# Altium schematic sheet AMDC.SchDoc: Advanced Motor Drive Controller
size Letter; Engineer: Nathan Petersen; DocumentNumber: 1; Revision: v1.2; SheetNumber: 1; SheetTotal: 23
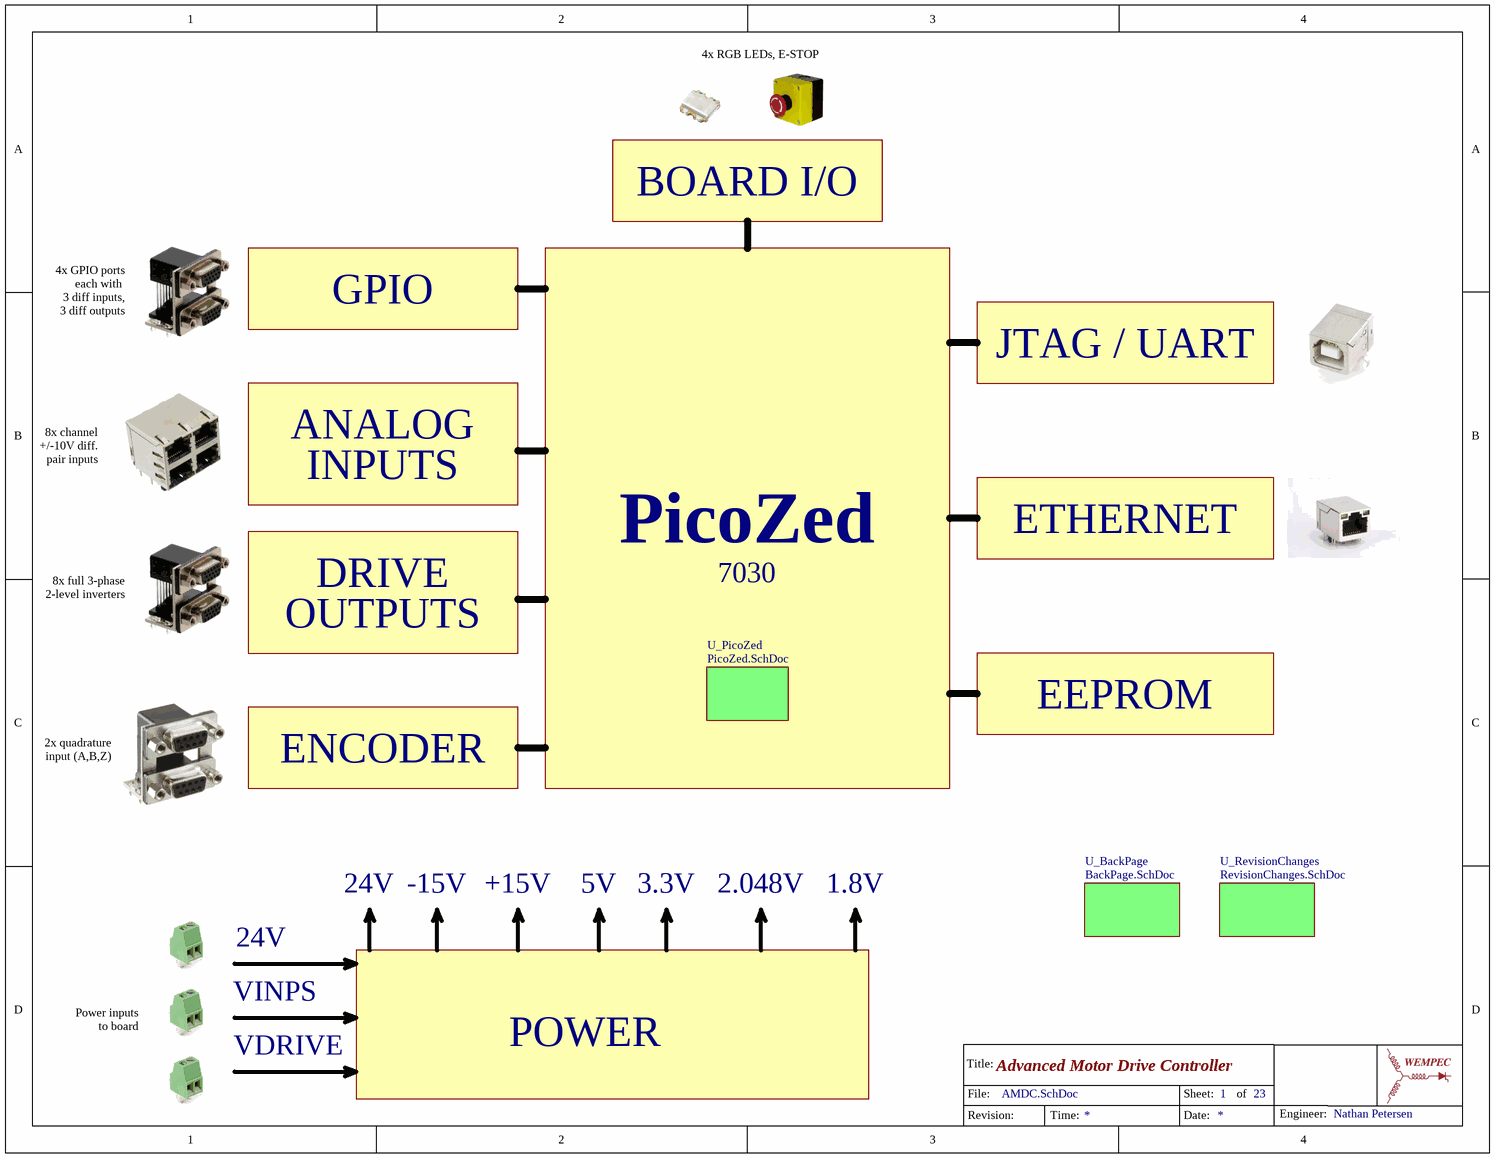
[diagram p0: AMDC.SchDoc]

## Sub-sheets
U_BackPage = BackPage.SchDoc: no entries
U_PicoZed = PicoZed.SchDoc: no entries
U_RevisionChanges = RevisionChanges.SchDoc: no entries

## Notes on the sheet
- 4x RGB LEDs, E-STOP
- BOARD I/O
- GPIO
- 4x GPIO ports
  each with
  3 diff inputs,
  3 diff outputs
- JTAG / UART
- ANALOG
- 8x channel
  +/-10V diff.
  pair inputs
- INPUTS
- DRIVE
- PicoZed
- 7030
- ETHERNET
- 8x full 3-phase
  2-level inverters
- OUTPUTS
- EEPROM
- 2x quadrature
  input (A,B,Z)
- ENCODER
- 24V
- -15V
- +15V
- 5V
- 3.3V
- 2.048V
- 1.8V
- Power inputs
  to board
- VINPS
- VDRIVE
- POWER
- Title:
- File:
- Sheet:
- of
- Revision:
- Time:
- Date:
- Engineer: